# EAGLE design sensor_module_temp_pulse_light_v1 (EAGLE 7.6.0)
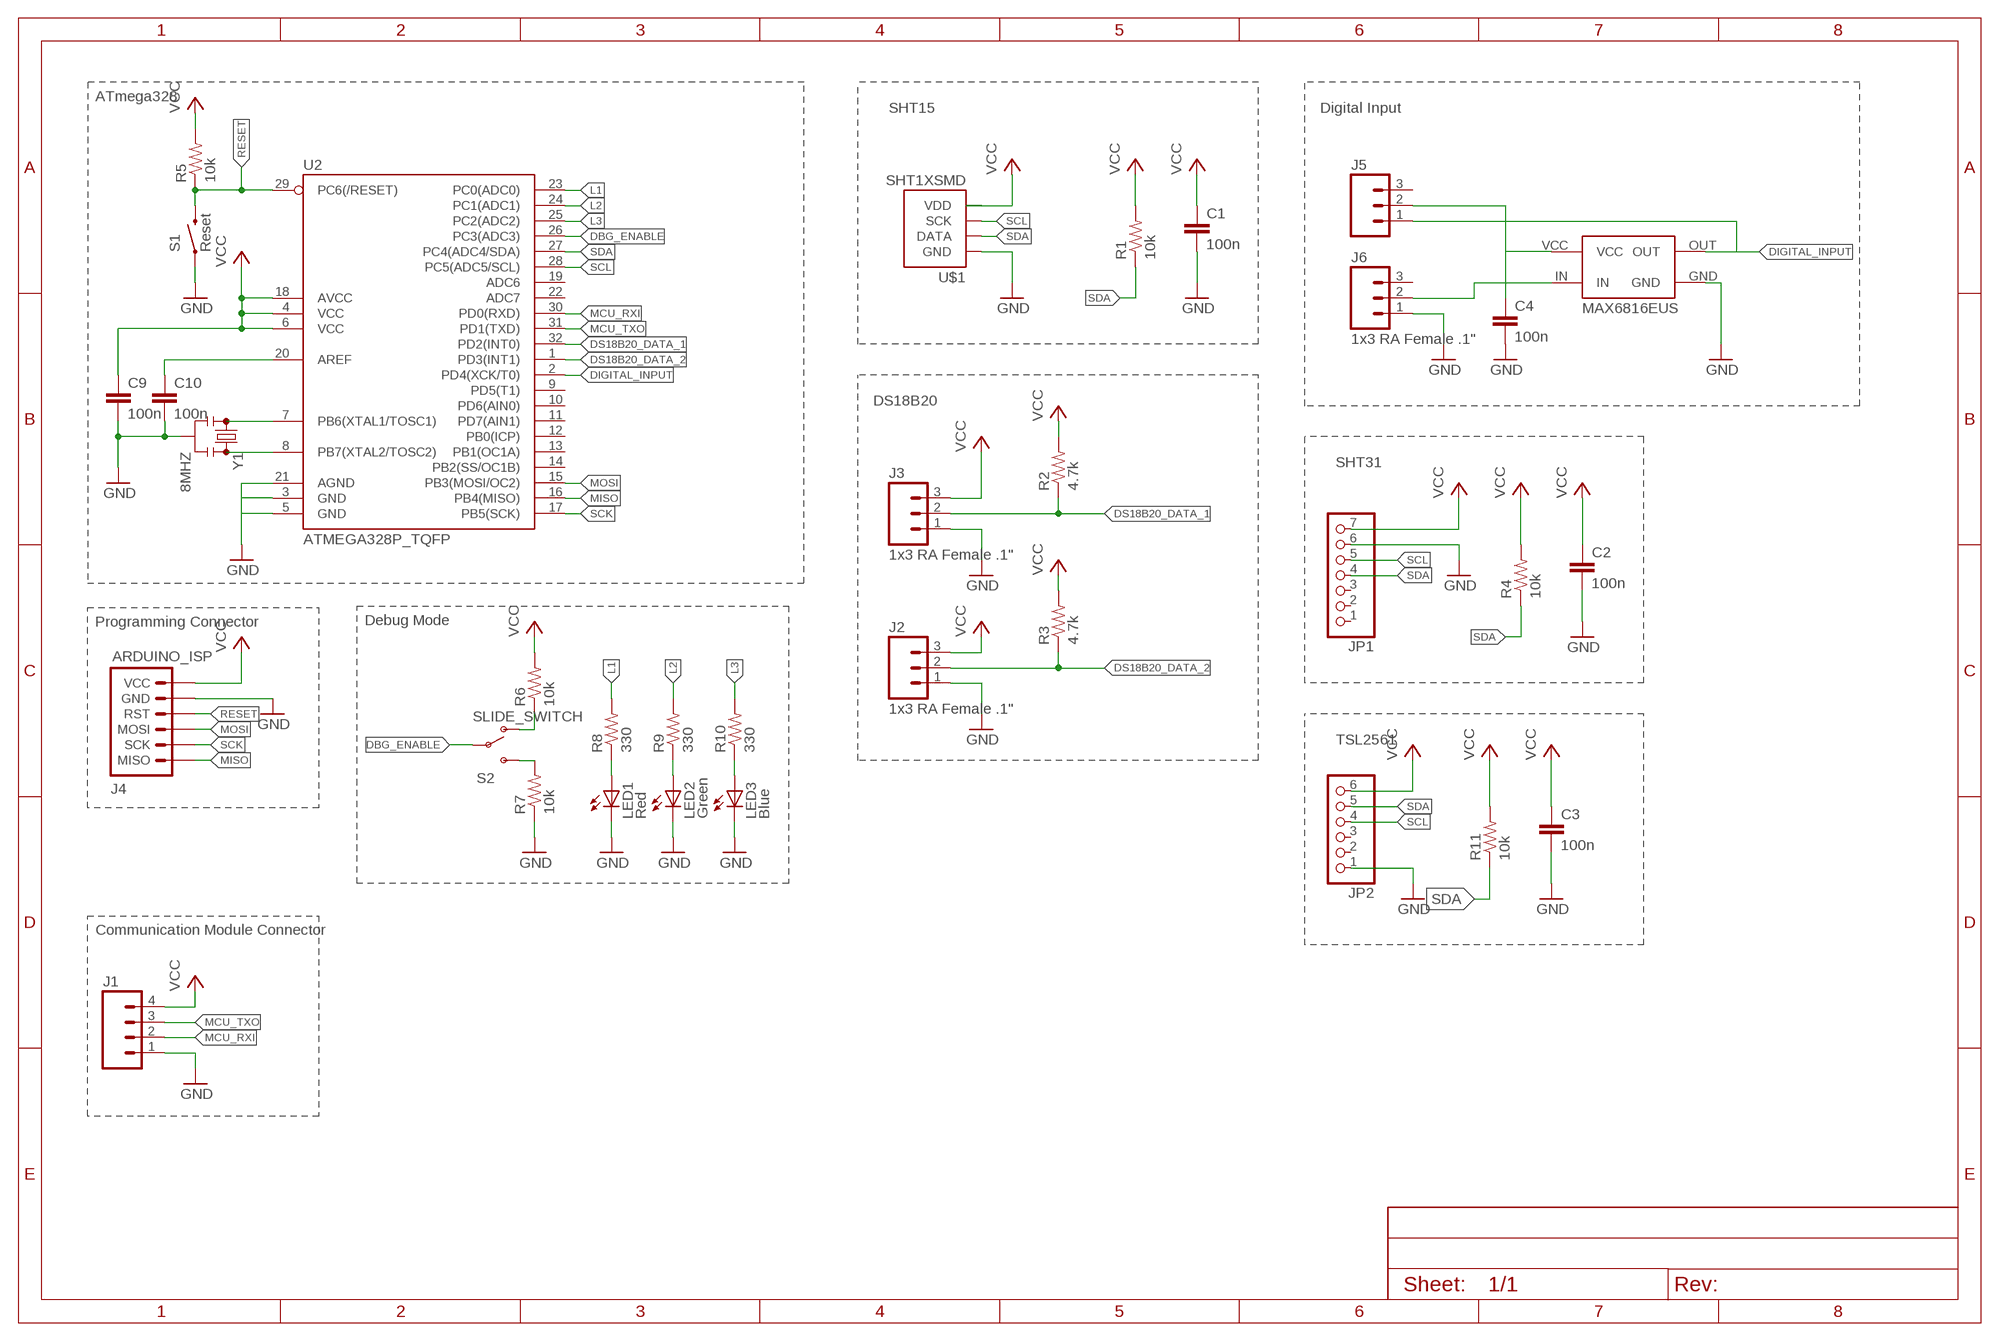
[diagram p0: schematic, sheet 1]
FRAME1 (FRAME-A4L): CNAME: Communication Module; CREVISION: 2.0

## Parts
C1  100n  C  [C0805]
C2  100n  C  [C0805]
C3  100n  C  [C0805]
C4  100n  C  [C0805]
C9  100n  C  [C0805]
C10  100n  C  [C0805]
J1  M041X04_NO_SILK  [1X04_NO_SILK]
J2  1x3 RA Female .1"  M03SMD_RA_FEMALE  [1X03_SMD_RA_FEMALE]
J3  1x3 RA Female .1"  M03SMD_RA_FEMALE  [1X03_SMD_RA_FEMALE]
J4  ARDUINO_ISP  [M-2X3]
J5  M031X03_NO_SILK  [1X03_NO_SILK]
J6  1x3 RA Female .1"  M03SMD_RA_FEMALE  [1X03_SMD_RA_FEMALE]
JP1  PINHD-1X7  [1X07]
JP2  PINHD-1X6  [1X06]
LED1  Red  LEDSML0805  [SML0805]
LED2  Green  LEDSML0805  [SML0805]
LED3  Blue  LEDSML0805  [SML0805]
R1  10k  RESISTOR0805-RES  [0805]
R2  4.7k  RESISTOR0805-RES  [0805]
R3  4.7k  RESISTOR0805-RES  [0805]
R4  10k  RESISTOR0805-RES  [0805]
R5  10k  RESISTOR0805-RES  [0805]
R6  10k  RESISTOR0805-RES  [0805]
R7  10k  RESISTOR0805-RES  [0805]
R8  330  RESISTOR0805-RES  [0805]
R9  330  RESISTOR0805-RES  [0805]
R10  330  RESISTOR0805-RES  [0805]
R11  10k  RESISTOR0805-RES  [0805]
S1  Reset  PUSHBUTTON  [M-PUSHBUTTON-SMD]
S2  SLIDE_SWITCH  [P-JS202011SCQN]
U2  ATMEGA328P_TQFP  [TQFP32-08]
U$1  SHT1XSMD  [SHT1X]
U$2  MAX6816EUS  [SOT143]
Y1  8MHZ  RESONATOR8MHZ  [RESONATOR-SMD]

## Nets
DBG_ENABLE: S2.P$2(MIDDLE) S2.P$5(MIDDLE) U2.26(PC3(ADC3))
DIGITAL_INPUT: J5.1 U2.2(PD4(XCK/T0)) U$2.OUT
DS18B20_DATA_1: J3.2 R2.1 U2.32(PD2(INT0))
DS18B20_DATA_2: J2.2 R3.1 U2.1(PD3(INT1))
GND [GND]: C1.2 C2.2 C3.2 C4.2 C9.2 C10.2 J1.1 J2.1 J3.1 J4.P$5(GND) J6.1 JP1.6 JP2.1 LED1.C LED2.C LED3.C R7.1 S1.1(LEFT) S1.2(LEFT) U2.3(GND) U2.5(GND) U2.21(AGND) U$1.1(GND) U$2.GND Y1.2
L1: R8.2 U2.23(PC0(ADC0))
L2: R9.2 U2.24(PC1(ADC1))
L3: R10.2 U2.25(PC2(ADC2))
MCU_RXI: J1.2 U2.30(PD0(RXD))
MCU_TXO: J1.3 U2.31(PD1(TXD))
MISO: J4.P$1(MISO) U2.16(PB4(MISO))
MOSI: J4.P$3(MOSI) U2.15(PB3(MOSI/OC2))
N$1: U2.8(PB7(XTAL2/TOSC2)) Y1.3
N$2: U2.7(PB6(XTAL1/TOSC1)) Y1.1
N$4: J6.2 U$2.IN
N$5: LED3.A R10.1
N$6 [Vsupply]: C4.1 J5.2 U$2.VCC
N$11: LED2.A R9.1
N$15: C10.1 U2.20(AREF)
N$30: LED1.A R8.1
N$34: R7.2 S2.P$1(LOWER) S2.P$4(LOWER)
N$35: R6.1 S2.P$3(UPPER) S2.P$6(UPPER)
RESET: J4.P$4(RST) R5.1 S1.3(RIGHT) S1.4(RIGHT) U2.29(PC6(/RESET))
SCK: J4.P$2(SCK) U2.17(PB5(SCK))
SCL: JP1.5 JP2.4 U2.28(PC5(ADC5/SCL)) U$1.3(SCK)
SDA: JP1.4 JP2.5 R1.1 R4.1 R11.1 U2.27(PC4(ADC4/SDA)) U$1.2(DATA)
VCC [Vsupply]: C1.1 C2.1 C3.1 C9.1 J1.4 J2.3 J3.3 J4.P$6(VCC) JP1.7 JP2.6 R1.2 R2.2 R3.2 R4.2 R5.2 R6.2 R11.2 U2.4(VCC) U2.6(VCC) U2.18(AVCC) U$1.4(VDD)
Unconnected: J5.3 J6.3 JP1.1 JP1.2 JP1.3 JP2.2 JP2.3 U2.9(PD5(T1)) U2.10(PD6(AIN0)) U2.11(PD7(AIN1)) U2.12(PB0(ICP)) U2.13(PB1(OC1A)) U2.14(PB2(SS/OC1B)) U2.19(ADC6) U2.22(ADC7)

## Notes on the sheet
- ATmega328
- SHT15 | Digital Input
- DS18B20
- SHT31
- Programming Connector | Debug Mode
- TSL2561
- Communication Module Connector

## Library data of the parts
C1-C4 C9 C10 = eagle-ltspice:C: CAPACITOR, European symbol; SPICEMODEL: NONE; SPICEPREFIX: C
J1 = SparkFun-Connectors:M04: Header 4 Standard 4-pin 0.1" header. Use with straight break away headers (SKU : PRT-00116), right angle break away headers (PRT-00553), swiss pins (PRT-00743), machine pins (PRT-00117), and female headers (PRT-00115). Molex polarized connector foot print use with SKU : PRT-08231 with associated crimp pins and housings. 1MM SMD Version SKU: PRT-10208; PROD_ID: CONN-09696
J2 J3 J6 = SparkFun-Connectors:M03: Header 3 Standard 3-pin 0.1" header. Use with straight break away headers (SKU : PRT-00116), right angle break away headers (PRT-00553), swiss pins (PRT-00743), machine pins (PRT-00117), and female headers (PRT-00115). Molex polarized connector foot print use with SKU : PRT-08232 with associated crimp pins and housings.; PROD_ID: CONN-10926
J4 = marc_library:ARDUINO_ISP: AVR ISP 6-pin inline header for Arduino ISP
J5 = SparkFun-Connectors:M03: Header 3 Standard 3-pin 0.1" header. Use with straight break away headers (SKU : PRT-00116), right angle break away headers (PRT-00553), swiss pins (PRT-00743), machine pins (PRT-00117), and female headers (PRT-00115). Molex polarized connector foot print use with SKU : PRT-08232 with associated crimp pins and housings.
JP1 = pinhead:PINHD-1X7: PIN HEADER
JP2 = pinhead:PINHD-1X6: PIN HEADER
LED1-LED3 = led:LED: LED OSRAM: - CHIPLED LG R971, LG N971, LY N971, LG Q971, LY Q971, LO R971, LY R971 LH N974, LH R974 LS Q976, LO Q976, LY Q976 LO Q996 - Hyper CHIPLED LW Q18S LB Q993, LB Q99A, LB R99A - SideLED LS A670, LO A670, LY A670, LG A670, LP A670 LB A673, LV A673, LT A673, LW A673 LH A674 LY A675 LS A676, LA A676, LO A676, LY A676, LW A676 LS A679, LY A679, LG A679 - Hyper Micro SIDELED® LS Y876, LA Y876, LO Y876, LY Y876 LT Y87S - SmartLED LW L88C, LW L88S LB L89C, LB L89S, LG L890 LS L89K, LO L89K, LY L89K LS L896, LA L896, LO L896, LY L896 - TOPLED LS T670, LO T670, LY T670, LG T670, LP T670 LSG T670, LSP T670, LSY T670, LOP T670, LYG T670 LG T671, LOG T671, LSG T671 LB T673, LV T673, LT T673, LW T673 LH T674 LS T676, LA T676, LO T676, LY T676, LB T676, LH T676, LSB T676, LW T676 LB T67C, LV T67C, LT T67C, LS T67K, LO T67K, LY T67K, LW E67C LS E67B, LA E67B, LO E67B, LY E67B, LB E67C, LV E67C, LT E67C LW T67C LS T679, LY T679, LG T679 LS T770, LO T770, LY T770, LG T770, LP T770 LB T773, LV T773, LT T773, LW T773 LH T774 LS E675, LA E675, LY E675, LS T675 LS T776, LA T776, LO T776, LY T776, LB T776 LHGB T686 LT T68C, LB T68C - Hyper Mini TOPLED® LB M676 - Mini TOPLED Santana® LG M470 LS M47K, LO M47K, LY M47K Source: http://www.osram.convergy.de LUXEON: - LUMILED® LXK2-PW12-R00, LXK2-PW12-S00, LXK2-PW14-U00, LXK2-PW14-V00 LXK2-PM12-R00, LXK2-PM12-S00, LXK2-PM14-U00 LXK2-PE12-Q00, LXK2-PE12-R00, LXK2-PE12-S00, LXK2-PE14-T00, LXK2-PE14-U00 LXK2-PB12-K00, LXK2-PB12-L00, LXK2-PB12-M00, LXK2-PB14-N00, LXK2-PB14-P00, LXK2-PB14-Q00 LXK2-PR12-L00, LXK2-PR12-M00, LXK2-PR14-Q00, LXK2-PR14-R00 LXK2-PD12-Q00, LXK2-PD12-R00, LXK2-PD12-S00 LXK2-PH12-R00, LXK2-PH12-S00 LXK2-PL12-P00, LXK2-PL12-Q00, LXK2-PL12-R00 Source: www.luxeon.com KINGBRIGHT: KA-3528ASYC Source: www.kingbright.com
R1-R11 = SparkFun-Passives:RESISTOR: Resistor Basic schematic elements and footprints for 0603, 1206, and PTH resistors.
S1 = marc_library:PUSHBUTTON
S2 = marc_library:SLIDE_SWITCH: SWCH-10651 Side-actuated SPDT slide switch, as used on the Arduino Pro
U2 = marc_library:ATMEGA328P_TQFP; PROD_ID: IC-09069
U$1 = SparkFun-Sensors:SHT1X: SHT1x Humdity Sensor Sensirion humdity sensor. Schematic element and footprint proven. Spark Fun Electronics SKU : COM-08227; PROD_ID: IC-08303
U$2 = myownthings:MAX6816EUS
Y1 = marc_library:RESONATOR: Resonator Small SMD resonator. Used, eg, on the Arduino Pro/ Pro Mini boards. 8MHz- XTAL-08895 16MHz- XTAL-08900; PROD_ID: XTAL-08895

## Net classes
0 default: width 0.3 mm
1 Vsupply: width 0.5 mm
5 GND: width 0.5 mm

## Board
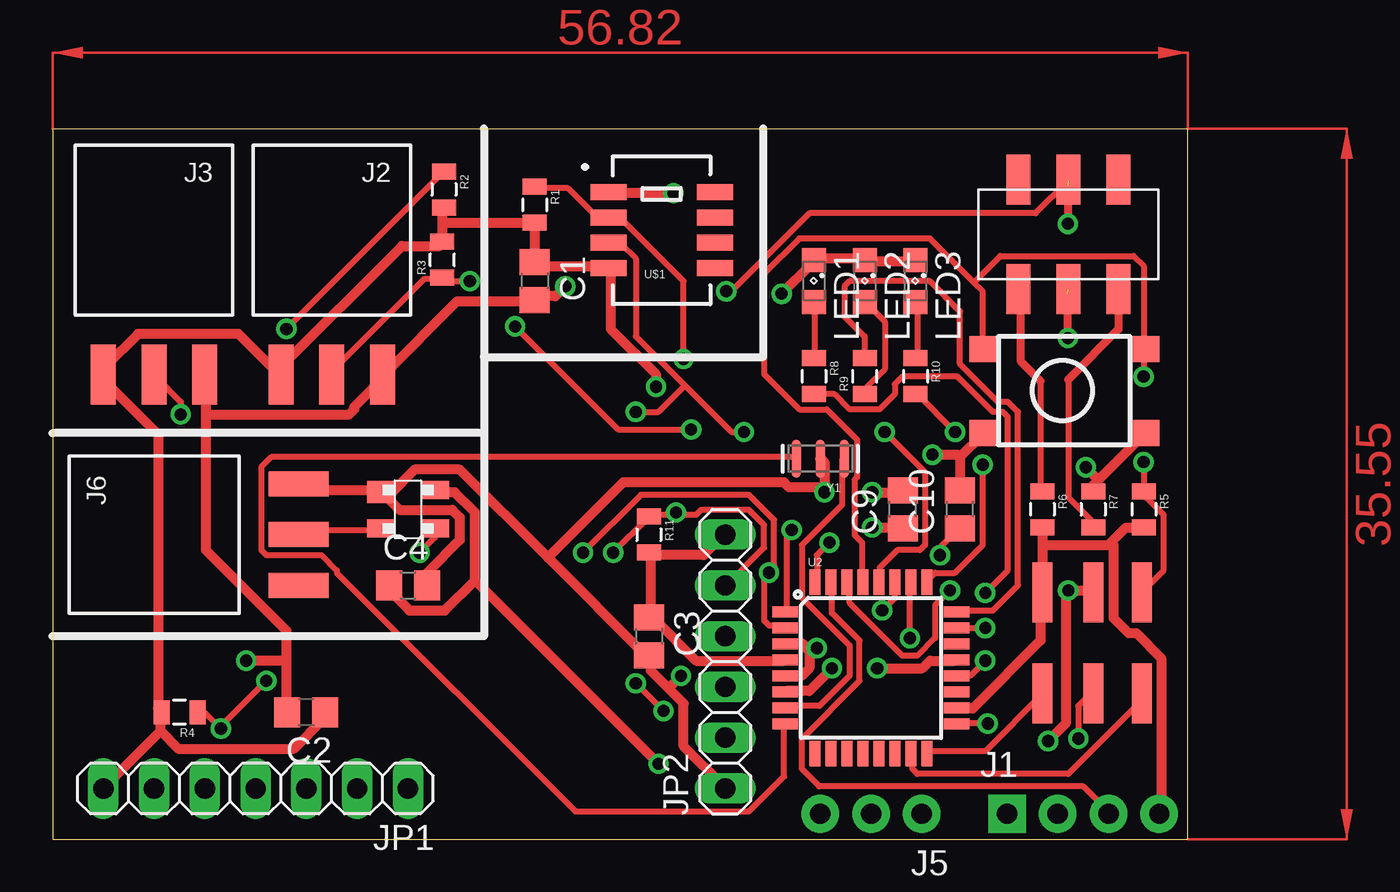
[diagram p1: board, top side]
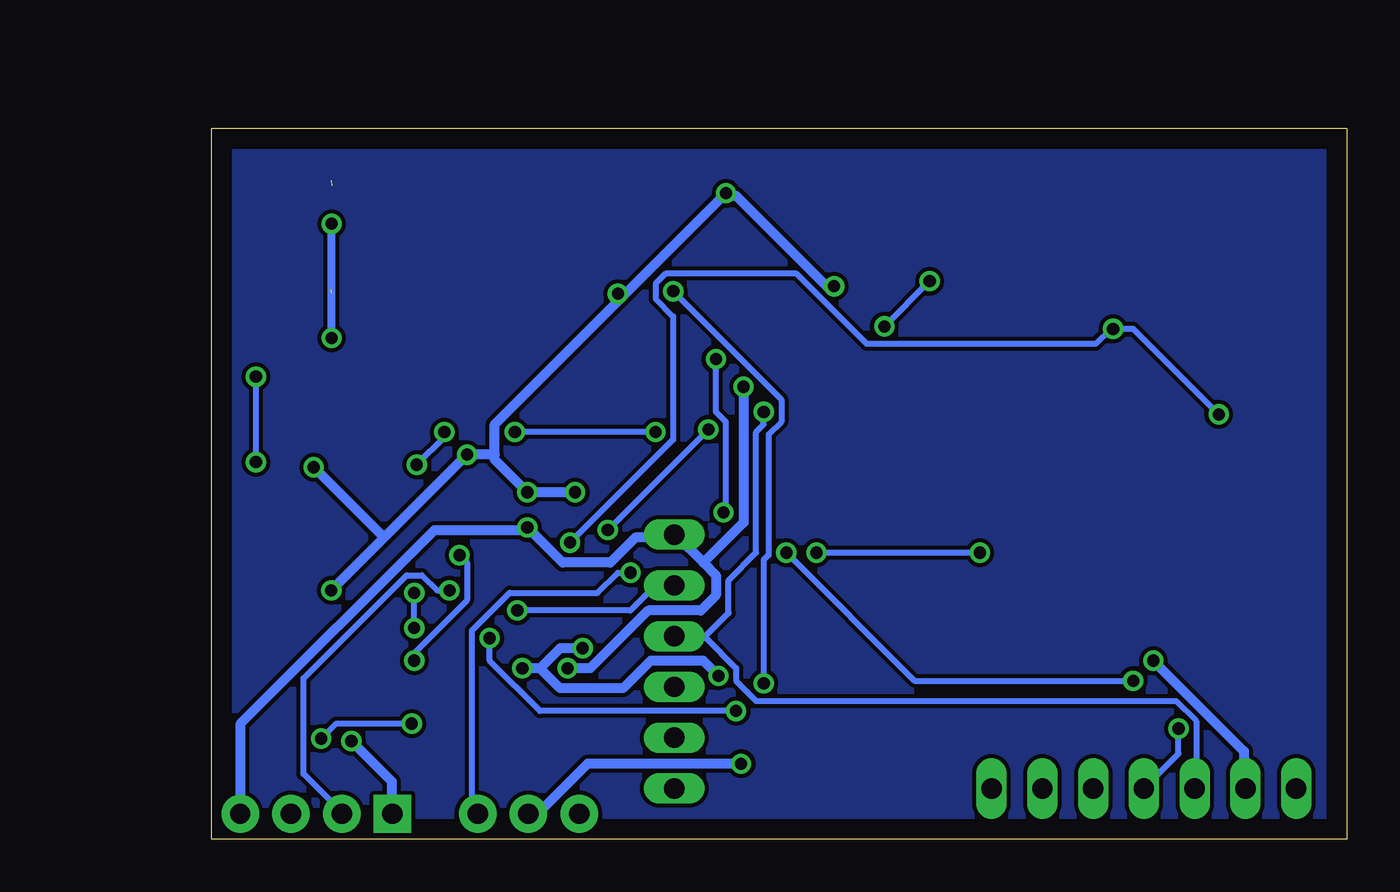
[diagram p2: board, bottom side, seen from below]

Size 56.82 x 35.56 mm. Coordinates in mm from the lower left corner, seen from the top.
Outline: 56.82,35.55 56.82,0 0,0 0,35.55
Outline: 0,35.56 56.82,35.56
Copper layers (1*16): Top 0.035mm / dielectric 1.5mm / Bottom 0.035mm
Design rules "default": minimum track width 10mil, minimum drill 24mil, track to track 8mil, track to pad 8mil, pad to pad 8mil, via to via 8mil, smd to smd 8mil, copper to edge 40mil, drill to drill 8mil, minimum pad ring 10mil, minimum via ring 8mil, stop-mask expansion 4mil, vias tented up to drill 0mil, thermal gap 10mil

### Footprints (pad centres in the part's own frame; a part is rotated, then mirrored left to right if it is on the bottom)
C0805 = smd 1.3 x 1.5: 1 -0.95,0; 2 0.95,0
1X04_NO_SILK = drill 1.016 pad 1.88 square: 1 0,0 | drill 1.016 pad 1.88: 2 2.54,0; 3 5.08,0; 4 7.62,0
1X03_SMD_RA_FEMALE = smd 1.25 x 3: 1 -2.54,7.225; 2 0,7.225; 3 2.54,7.225
M-2X3 = smd 1 x 3: P$1 0,0; P$2 2.54,0; P$3 4.98,0; P$4 4.98,5.05; P$5 2.54,5.05; P$6 0,5.05
1X03_NO_SILK = drill 1.016 pad 1.88: 1 0,0; 2 2.54,0; 3 5.08,0
1X07 = drill 1.016 long: 1 -7.62,0; 2 -5.08,0; 3 -2.54,0; 4 0,0; 5 2.54,0; 6 5.08,0; 7 7.62,0
1X06 = drill 1.016 long: 1 -6.35,0; 2 -3.81,0; 3 -1.27,0; 4 1.27,0; 5 3.81,0; 6 6.35,0
SML0805 = smd 1.2 x 1.2: A 1.05,0; C -1.05,0
0805 = smd 0.8 x 1.2: 1 -0.9,0; 2 0.9,0
M-PUSHBUTTON-SMD = smd 1.55 x 1.3: 1 0,0; 2 7.95,0; 3 0,-4.2; 4 7.95,-4.2
P-JS202011SCQN = smd 1.2 x 2.5: P$1 0,0; P$2 2.5,0; P$3 5,0; P$4 0,5.5; P$5 2.5,5.5; P$6 5,5.5
TQFP32-08 = smd 1.27 x 0.559: 1 -4.293,2.8; 2 -4.293,2; 3 -4.293,1.2; 4 -4.293,0.4; 5 -4.293,-0.4; 6 -4.293,-1.2; 7 -4.293,-2; 8 -4.293,-2.8; 17 4.293,-2.8; 18 4.293,-2; 19 4.293,-1.2; 20 4.293,-0.4; 21 4.293,0.4; 22 4.293,1.2; 23 4.293,2; 24 4.293,2.8 | smd 0.559 x 1.27: 9 -2.8,-4.293; 10 -2,-4.293; 11 -1.2,-4.293; 12 -0.4,-4.293; 13 0.4,-4.293; 14 1.2,-4.293; 15 2,-4.293; 16 2.8,-4.293; 25 2.8,4.293; 26 2,4.293; 27 1.2,4.293; 28 0.4,4.293; 29 -0.4,4.293; 30 -1.2,4.293; 31 -2,4.293; 32 -2.8,4.293
SHT1X = smd 1.8 x 0.8: 1 -2.667,1.905; 2 -2.667,0.635; 3 -2.667,-0.635; 4 -2.667,-1.905; 5 2.667,-1.905; 6 2.667,-0.635; 7 2.667,0.635; 8 2.667,1.905
SOT143 = smd 1.4 x 1.1: GND -1.35,0.86 | smd 1.4 x 0.9: IN -1.35,-0.96; OUT 1.35,-0.96; VCC 1.35,0.96
RESONATOR-SMD = smd 0.45 x 1.905: 1 -1.2,0; 2 0,0; 3 1.2,0

### Placement (x,y rotation side)
C1  24.13,27.94 270 top
C2  12.7,6.35 180 top
C3  29.84,10.16 270 top
C4  17.78,12.7 0 top
C9  42.55,16.51 90 top
C10  45.4,16.51 90 top
J1  47.76,1.27 0 top
J2  13.97,30.48 180 top
J3  5.08,30.48 180 top
J4  49.53,7.3 0 top
J5  43.5,1.27 180 top
J6  5.08,15.24 270 top
JP1  10.16,2.54 180 top
JP2  33.66,8.89 90 top
LED1  38.1,27.94 270 top
LED2  40.64,27.94 270 top
LED3  43.18,27.94 270 top
R1  24.13,31.75 270 top
R2  19.59,32.52 270 top
R3  19.5,29 90 top
R4  6.35,6.35 180 top
R5  54.61,16.51 270 top
R6  49.53,16.51 270 top
R7  52.07,16.51 270 top
R8  38.1,23.18 270 top
R9  40.64,23.18 90 top
R10  43.18,23.18 270 top
R11  29.84,15.24 270 top
S1  54.61,20.32 180 top
S2  53.34,33.02 180 top
U2  40.96,8.57 0 top
U$1  30.48,30.48 0 top
U$2  17.78,16.51 0 top
Y1  38.42,19.05 180 top

### Tracks (layer width: path | path; a pad name or v marks a point on that pad's centre or on a via)
DBG_ENABLE  (via drill 0.6, 0.61)  (2 unrouted)
  Top 0.3: v42.9,10.06 42.9,12.83 U2.26 | v29.19,7.8 v30.57,6.42 | v33.71,27.42 33.97,27.42 37.87,31.32 49.19,31.32 50.82,32.96 S2.P$2
  Top 0.406: 50.8,32.7 v50.8,30.8 | v50.8,25.08 50.8,27.3
  Bottom 0.3: v42.9,10.06 42.9,8.93 40.38,6.42 v30.57,6.42 | v29.19,7.8 29.19,13.96 28.93,14.21 28.93,20.25 28.3,20.88 28.3,22.02 v33.71,27.42
  Bottom 0.406: v50.8,25.08 v50.8,30.8
DIGITAL_INPUT  (via drill 0.61)
  Top 0.3: U2.2 36.61,10.69 35.85,10.69 35.6,10.95 35.6,13.08 v35.85,13.34 35.85,13.46 36.1,13.71 36.1,15.98 34.85,17.23 29.44,17.23 v26.54,14.34 | v18.37,14.34 19.12,15.1 19.12,15.47 U$2.OUT
  Bottom 0.3: v35.85,13.34 36.48,13.34 37.49,12.33 41.89,12.33 43.78,10.44 43.78,1.64 43.53,1.38 J5.1 | v26.54,14.34 v18.37,14.34
DS18B20_DATA_1  (via drill 0.61)
  Top 0.3: v11.7,25.54 19.5,33.34 R2.1 | v6.42,21.26 6.42,21.89 5.16,23.15 J3.2 | v38.87,14.84 38.24,14.21 38.24,12.96 U2.32
  Bottom 0.3: v6.42,21.26 10.69,25.54 v11.7,25.54 11.82,25.54 12.58,24.78 24.03,24.78 27.55,28.3 34.09,28.3 34.59,27.8 34.59,27.05 33.71,26.17 33.71,20 v38.87,14.84
DS18B20_DATA_2  (via drill 0.61)
  Top 0.3: J2.2 14.09,23.27 14.09,23.52 18.62,28.05 19.5,28.05 R3.1 19.5,27.93 v20.88,27.93 | v36.98,15.47 36.73,15.22 36.73,11.45 U2.1 | v31.95,20.5 28.3,20.5 v23.15,25.66
  Bottom 0.3: v31.95,20.5 v36.98,15.47 | v20.88,27.93 v23.15,25.66
GND  (via drill 0.61)
  Top 0.5: U$2.GND 16.35,17.49 12.58,17.49 12.33,17.74 J6.1 | C4.2 18.74,12.71 18.74,13.34 20.38,14.97 20.38,16.1 20,16.48 17.36,16.48 16.61,17.23 U$2.GND | 37.87,9.44 37.87,8.55 37.49,8.18 36.73,8.18 U2.5 | 37.87,9.44 37.49,9.81 36.73,9.81 U2.3 | v41.26,8.55 43.53,8.55 43.9,8.93 45.16,8.93 U2.21 | v38.24,9.56 37.99,9.56 37.87,9.44 | 30.82,7.55 31.58,6.79 31.58,4.66 33.59,2.64 JP2.1 | 30.82,7.55 29.94,8.43 29.94,9.18 C3.2 29.69,9.18 24.78,14.09 | 30.82,7.55 v31.45,8.18 | 24.78,14.09 20.38,18.49 18.11,18.49 16.86,17.23 U$2.GND | 11.7,8.93 11.7,10.44 7.67,14.47 7.67,21.26 | 11.7,8.93 11.7,6.42 C2.2 | 7.67,21.26 7.67,23.15 J3.1 | 11.7,8.93 v9.69,8.93 | 7.67,21.26 14.84,21.26 15.1,21.51 15.1,21.64 16.48,23.02 J2.1 16.61,23.27 20.25,26.92 24.03,26.92 C1.2 24.28,27.17 25.16,27.17 v25.66,27.68 | 52.33,17.99 54.6,20.25 S1.1 | 52.33,17.99 52.08,17.74 52.08,17.49 R7.1 | 45.41,19.12 45.41,17.49 C10.2 | 45.41,19.12 46.55,20.25 S1.2 | LED3.C 43.15,28.93 40.88,28.93 LED2.C 40.63,29.06 38.12,29.06 LED1.C 37.99,28.81 v36.48,27.3 | v41.01,17.36 42.52,17.36 C9.2 | Y1.2 38.49,19 38.62,18.87 v38.62,17.36 38.49,17.61 36.86,17.61 36.61,17.86 28.56,17.86 24.78,14.09 | v31.07,32.33 27.93,32.33 U$1.1 | v44.03,19.25 45.29,19.25 45.41,19.12 | J4.P$5 51.95,12.45 v50.82,12.45 50.7,12.33 50.7,5.79 v49.82,4.91 | v51.7,18.62 52.33,17.99
  Bottom 0.5: 40.38,8.55 v41.26,8.55 | 40.38,8.55 39.38,9.56 v38.24,9.56 | 40.38,8.55 39.38,7.55 36.23,7.55 34.85,8.93 32.2,8.93 v31.45,8.18 | v9.69,8.93 5.16,4.4 5.16,2.64 JP1.6 | v38.62,17.36 v41.01,17.36 42.65,19 42.65,19.25 | 36.23,27.17 42.65,20.76 42.65,19.25 | 36.23,27.17 v31.07,32.33 30.95,32.2 30.57,32.2 26.04,27.68 v25.66,27.68 | v36.48,27.3 36.36,27.3 36.23,27.17 | 42.65,19.25 v44.03,19.25 48.18,15.1 | 48.18,15.1 v50.82,12.45 | 48.18,15.1 v51.7,18.62 | v49.82,4.91 47.8,2.89 47.8,1.38 J1.1
L1  (via drill 0.61)
  Top 0.3: v46.67,12.33 47.8,13.46 47.8,21.13 47.55,21.39 47.05,21.39 45.29,23.15 42.52,23.15 42.14,22.77 42.14,22.27 41.39,21.51 39.88,21.51 39.12,22.27 38.12,22.27 R8.2 | v46.67,10.57 45.29,10.57 U2.23
  Bottom 0.3: v46.67,10.57 v46.67,12.33
L2
  Top 0.3: R9.2 40.63,24.15 40.63,25.16 39.63,26.17 39.63,27.68 39.88,27.93 43.9,27.93 45.41,26.42 45.41,23.78 47.3,21.89 47.8,21.89 48.31,21.39 48.31,12.71 47.05,11.45 45.29,11.45 U2.24
L3  (via drill 0.61)
  Top 0.3: v45.16,20.38 43.27,22.27 R10.2 | v46.55,18.74 46.55,14.72 45.16,13.34 44.16,13.34 43.78,12.96 U2.25
  Bottom 0.3: v45.16,20.38 45.16,20.13 v46.55,18.74
MCU_RXI  (via drill 0.61)
  Top 0.3: v44.91,12.45 44.16,11.7 44.16,10.06 43.27,9.18 42.52,9.18 39.88,11.82 39.88,12.83 U2.30
  Bottom 0.3: v44.91,12.45 45.54,12.45 46.29,13.21 47.05,13.21 52.21,8.05 52.21,3.27 50.32,1.38 J1.2
MCU_TXO
  Top 0.3: U2.31 39,12.83 39,11.32 40.38,9.94 40.38,7.92 37.49,5.03 37.49,3.52 38.37,2.64 51.58,2.64 52.84,1.38 J1.3
MISO
  Top 0.3: U2.16 43.78,4.4 46.67,4.4 49.56,7.3 J4.P$1
MOSI
  Top 0.3: U2.15 43.02,4.28 43.02,3.52 43.27,3.27 50.82,3.27 54.47,6.92 54.47,7.3 J4.P$3
N$1
  Top 0.3: U2.8 36.61,5.66 36.61,3.15 34.85,1.38 26.17,1.38 14.21,13.34 14.21,13.46 13.46,14.21 10.69,14.21 10.44,14.47 10.44,18.62 10.95,19.12 37.11,19.12 Y1.3
N$2
  Top 0.3: U2.7 36.73,6.67 38.37,6.67 39.88,8.18 39.88,9.69 37.49,12.08 37.49,14.72 39.5,16.73 39.5,19 Y1.1
N$3
  pour Bottom: 0,35.56 56.83,35.56 56.83,0 0,0
N$4
  Top 0.3: U$2.IN 16.35,15.47 12.45,15.47 12.33,15.35 J6.2
N$5
  Top 0.3: R10.1 43.27,24.15 43.27,26.8 LED3.A
N$6  (via drill 0.61)
  Top 0.5: 21.13,12.96 21.13,16.35 20.13,17.36 19.25,17.36 U$2.VCC | 21.13,12.96 19.62,11.45 17.86,11.45 16.73,12.58 C4.1 | 21.13,12.96 v30.32,3.77
  Bottom 0.5: v30.32,3.77 37.99,3.77 40.38,1.38 40.88,1.38 J5.2
N$11
  Top 0.3: R9.1 40.76,22.39 40.76,22.64 41.64,23.52 41.64,25.91 40.76,26.8 LED2.A
N$15  (via drill 0.61)
  Top 0.3: v46.67,8.93 45.92,8.18 45.29,8.18 U2.20 | v44.41,14.21 44.41,14.59 45.29,15.47 C10.1
  Bottom 0.3: v46.67,8.93 46.67,9.31 44.03,11.95 44.03,13.84 v44.41,14.21
N$30
  Top 0.3: R8.1 38.12,24.15 38.12,26.8 LED1.A
N$34
  Top 0.3: 50.82,23 50.82,17.11 51.95,15.98 51.95,15.72 R7.2 | 53.34,27.42 S2.P$4
  Top 0.406: 53.34,27.42 53.34,25.52 50.82,23
N$35
  Top 0.3: 49.44,22.93 49.44,17.49 R6.1 | 48.43,27.42 S2.P$6
  Top 0.406: 48.43,27.42 48.43,23.93 49.44,22.93
RESET  (via drill 0.61)
  Top 0.3: J4.P$4 54.6,12.45 55.6,13.46 55.6,16.23 54.72,17.11 54.72,17.36 R5.1 54.6,17.49 v54.6,18.87 | 46.11,27.86 46.55,27.42 46.55,24.53 S1.4 | 46.11,27.86 43.9,30.07 37.36,30.07 35.6,28.3 35.6,23.27 37.36,21.51 38.75,21.51 40.26,20 40.26,18.11 40.13,17.99 40.13,15.22 40.51,14.84 40.51,12.96 U2.29 | 46.11,27.86 47.43,29.19 54.09,29.19 54.6,28.68 54.6,24.53 S1.3 54.6,24.41 v54.6,23.15
  Bottom 0.3: v54.6,23.15 v54.6,18.87
SCK  (via drill 0.61)
  Top 0.3: v46.8,5.79 45.29,5.79 U2.17 | v51.33,5.03 51.33,6.67 51.95,7.3 J4.P$2
  Bottom 0.3: v46.8,5.79 50.57,5.79 v51.33,5.03
SCL  (via drill 0.61)
  Top 0.3: v41.64,20.38 43.65,18.37 43.65,14.72 43.4,14.47 42.27,14.47 41.39,13.59 41.39,12.96 U2.28 | v34.59,20.38 33.97,20.38 31.64,22.71 | 31.64,22.71 29.19,25.16 29.19,29.06 28.43,29.82 27.93,29.82 U$1.3 | 31.64,22.71 30.32,21.39 v29.19,21.39
  Bottom 0.3: v34.59,20.38 v41.64,20.38 | 32.08,10.06 30.57,8.55 30.57,7.92 29.56,6.92 8.55,6.92 7.55,5.91 7.55,2.64 JP1.5 | 32.08,10.06 33.59,10.06 JP2.4 | v29.19,21.39 29.19,20.76 29.56,20.38 29.56,14.34 30.95,12.96 30.95,11.32 32.08,10.19 32.08,10.06
SDA  (via drill 0.61)
  Top 0.3: R4.1 7.3,6.29 7.67,6.29 v8.43,5.54 8.43,5.66 v10.69,7.92 | R1.1 24.15,32.58 25.79,32.58 27.17,31.2 27.8,31.2 U$1.2 27.93,31.07 28.43,31.07 31.58,27.93 v31.58,24.03 | 31.2,16.23 32.2,16.23 32.46,16.48 34.85,16.48 35.6,15.72 35.6,14.59 33.71,12.71 JP2.5 | 31.2,16.23 29.94,16.23 R11.1 29.82,16.1 v28.05,14.34 | v41.51,11.45 42.14,12.08 42.14,12.83 U2.27 | v31.2,16.35 31.2,16.23
  Bottom 0.3: v8.43,5.54 8.43,4.28 10.06,2.64 JP1.4 | v41.51,11.45 35.85,11.45 34.72,12.58 33.71,12.58 JP2.5 | v31.58,24.03 31.58,21.39 31.07,20.88 31.07,16.48 v31.2,16.35 | v10.69,7.92 21.64,7.92 v28.05,14.34
VCC  (via drill 0.61)
  Top 0.5: U2.4 36.61,8.93 32.2,8.93 30.07,11.07 C3.1 29.94,11.2 29.94,14.21 R11.2 30.19,14.21 32.58,14.21 33.59,15.22 JP2.6 | v39,8.55 37.87,7.42 36.73,7.42 U2.6 | v41.01,15.6 42.52,15.6 C9.1 | 49.56,14.72 49.56,12.45 J4.P$6 49.44,12.2 49.44,9.94 46.04,6.54 45.29,6.54 U2.18 | 49.56,14.72 49.56,15.6 R6.2 | 52.96,14.84 52.84,14.72 49.56,14.72 | 52.96,14.84 53.72,15.6 54.6,15.6 R5.2 | J1.4 55.48,1.38 55.48,9.06 54.22,10.32 53.84,10.32 53.09,11.07 53.09,14.72 52.96,14.84 | 5.41,5.41 5.41,6.29 R4.2 5.28,6.54 5.28,20.25 2.52,23.02 J3.3 2.64,23.27 2.64,23.65 4.28,25.29 9.31,25.29 11.32,23.27 J2.3 11.32,23.52 17.49,29.69 19.37,29.69 R3.2 19.5,29.94 19.5,30.82 | JP1.7 5.41,5.41 | 5.41,5.41 6.29,4.53 12.08,4.53 13.59,6.04 13.59,6.29 C2.1 | 19.5,30.82 19.5,31.58 R2.2 | 19.5,30.82 23.9,30.82 R1.2 24.15,30.82 24.15,28.93 C1.1 24.28,28.68 27.8,28.68 U$1.4 27.93,28.43 27.93,25.54 30.19,23.27 v30.19,22.64
  Bottom 0.5: v39,8.55 37.87,8.55 34.97,11.45 32.33,11.45 31.58,12.2 31.58,13.21 32.2,13.84 | 32.2,13.84 33.59,15.22 JP2.6 33.84,15.1 35.6,15.1 36.86,13.84 39.25,13.84 v41.01,15.6 41.14,15.47 45.66,15.47 55.35,5.79 55.35,1.38 J1.4 | 32.2,13.84 30.19,15.85 v30.19,22.64
(copper drawn outside any net)
  shapes: Top area x2